# Altium schematic sheet PA.SchDoc
size A4
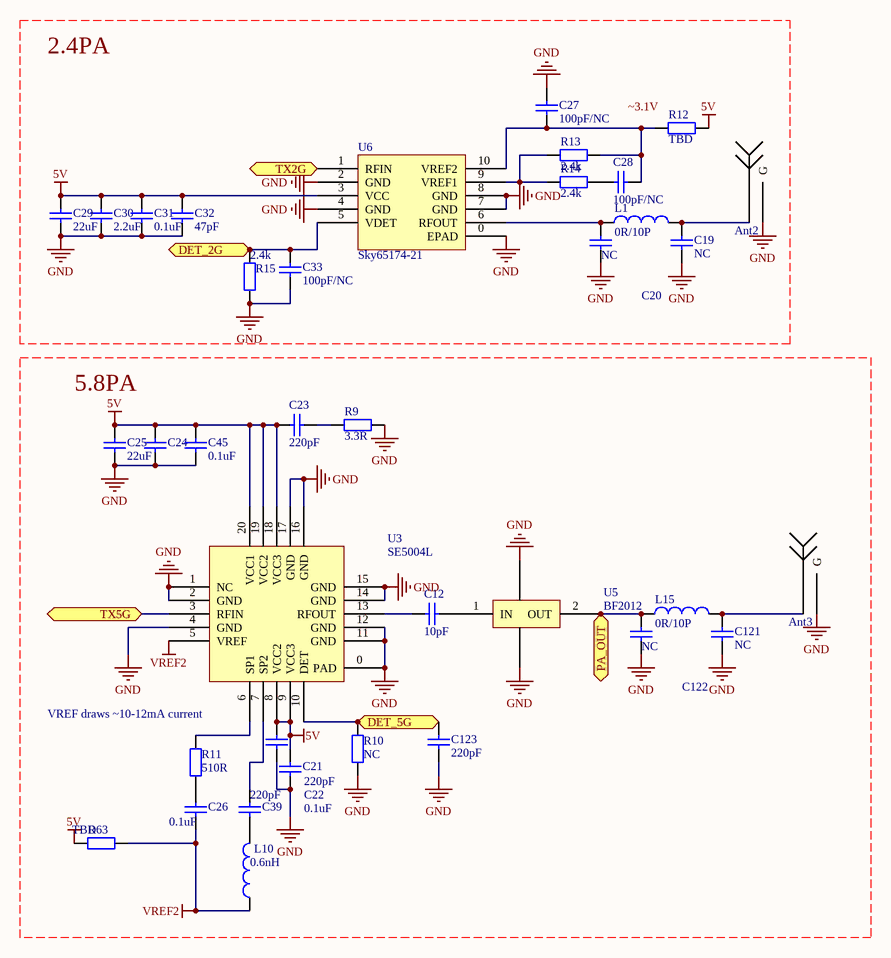
[diagram p0: PA.SchDoc]

## Parts
Ant2  Antenna  [SMA-2]  (value not drawn)
Ant3  Antenna  [SMA-2]  (value not drawn)
C12  value 10pF  [0402]  (hidden comment: Cap)
C19  value NC  [0402]  (hidden comment: Cap)
C20  value NC  [0402]  (hidden comment: Cap)
C21  value 0.1uF  [0402]  (hidden comment: Cap)
C22  value 220pF  [0402]  (hidden comment: Cap)
C23  value 220pF  [0402]  (hidden comment: Cap)
C24  1uF  [0603]  (value not drawn)
C25  value 22uF  [0805]  (hidden comment: Cap)
C26  value 0.1uF  [0402]  (hidden comment: Cap)
C27  value 100pF/NC  [0402]  (hidden comment: Cap)
C28  value 100pF/NC  [0402]  (hidden comment: Cap)
C29  value 22uF  [0805]  (hidden comment: Cap)
C30  value 2.2uF  [0603]  (hidden comment: Cap)
C31  value 0.1uF  [0402]  (hidden comment: Cap)
C32  value 47pF  [0402]  (hidden comment: Cap)
C33  value 100pF/NC  [0402]  (hidden comment: Cap)
C39  value 220pF  [0402]  (hidden comment: Cap)
C45  value 0.1uF  [0402]  (hidden comment: Cap)
C121  value NC  [0402]  (hidden comment: Cap)
C122  value NC  [0402]  (hidden comment: Cap)
C123  value 220pF  [0402]  (hidden comment: Cap)
L1  value 0R/10P  [0402]  (hidden comment: Inductor)
L10  value 0.6nH  [0402]  (hidden comment: Inductor)
L15  value 0R/10P  [0402]  (hidden comment: Inductor)
R9  value 3.3R  [0402]  (hidden comment: Res2)
R10  value NC  [0402]  (hidden comment: Res2)
R11  value 510R  [0402]  (hidden comment: Res2)
R12  value TBD  [0402]  (hidden comment: Res2)
R13  value 2.4k  [0402]  (hidden comment: Res2)
R14  value 2.4k  [0402]  (hidden comment: Res2)
R15  value 2.4k  [0402]  (hidden comment: Res2)
R63  TBD  [0603]
U3  SE5004L  [SE5004L]
U5  BF2012  [LFB2H5]
U6  Sky65174-21  [SKY65174-21]

## Ports
DET_2G, DET_5G, PA_OUT, TX2G, TX5G

## Nets
5V: C21.2 C22.2 C23.2 C24.1 C25.2 C29.1 C30.1 C31.1 C32.1 C45.1 R12.1 R63.2 U3.8(VCC2) U3.9(VCC3) U3.18(VCC3) U3.19(VCC2) U3.20(VCC1) U6.3(VCC)
GND: Ant2.GND(G) Ant3.GND(G) C19.2 C20.2 C21.1 C22.1 C24.2 C25.1 C27.1 C29.2 C30.2 C31.2 C32.2 C33.2 C45.2 C121.2 C122.2 C123.2 R9.1 R10.1 R15.1 U3.0(PAD) U3.1(NC) U3.2(GND) U3.4(GND) U3.11(GND) U3.12(GND) U3.14(GND) U3.15(GND) U3.16(GND) U3.17(GND) U5.0(GND) U6.0(EPAD) U6.2(GND) U6.4(GND) U6.7(GND) U6.8(GND)
VREF2: C26.1 L10.1 R63.1 U3.5(VREF)
DET_2G: C33.1 R15.2 U6.5(VDET) ; port DET_2G
DET_5G: C123.1 R10.2 U3.10(DET) ; port DET_5G
PA_OUT: C122.1 L15.1 U5.2(OUT) ; port PA_OUT
TX2G: U6.1(RFIN) ; port TX2G
TX5G: U3.3(RFIN) ; port TX5G
NetAnt2_1: Ant2.1 C19.1 L1.2
NetAnt3_1: Ant3.1 C121.1 L15.2
NetC12_1: C12.1 U3.13(RFOUT)
NetC12_2: C12.2 U5.1(IN)
NetC20_1: C20.1 L1.1 U6.6(RFOUT)
NetC23_1: C23.1 R9.2
NetC26_2: C26.2 R11.1
NetC27_2: C27.2 C28.2 R12.2 R13.1 U6.10(VREF2)
NetC28_1: C28.1 R14.1
NetC39_1: C39.1 L10.2
NetC39_2: C39.2 U3.7(SP2)
NetR11_2: R11.2 U3.6(SP1)
NetR13_2: R13.2 R14.2 U6.9(VREF1)

## Notes on the sheet
- 2.4PA
- 5.8PA
- VREF draws ~10-12mA current
- Labels drawn without touching a wire or pin: ~3.1V

## Library data of the parts
C12 C19-C33 C39 C45 C121-C123 = Cap: Capacitor; Published: 8-Jun-2000; LatestRevisionDate: 17-Jul-2002; LatestRevisionNote: Re-released for DXP Platform.; PackageReference: RAD-0.3; Publisher: Altium Limited; PackageDescription: Radial Cap, Thru-Hole; 2 Leads; 0.3 in Pin Spacing
L1 L10 L15 = Inductor: Code_IEC: 1005; Published: 8-Jun-2000; LatestRevisionDate: 29-May-2009; LatestRevisionNote: IPC-7351 Footprint Added.; PackageReference: 0402-A; Publisher: Altium Limited; PackageDescription: Chip Inductor; Code_JEITA: 0402
R9-R15 R63 = Res2: Resistor; Published: 8-Jun-2000; LatestRevisionDate: 17-Jul-2002; LatestRevisionNote: Re-released for DXP Platform.; PackageReference: AXIAL-0.4; Publisher: Altium Limited; PackageDescription: Axial Device, Thru-Hole; 2 Leads; 0.4 in Pin Spacing